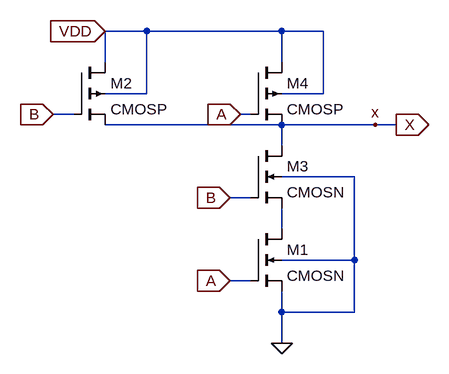
[diagram p0: schematic NAND3mA_2IN_SIMB.asc]
NAND3mA_2IN_SIMB.asc, the LTspice schematic file:
Version 4
SHEET 1 1484 824
WIRE 224 -240 160 -240
WIRE 432 -240 224 -240
WIRE 496 -240 432 -240
WIRE 160 -192 160 -240
WIRE 432 -192 432 -240
WIRE 224 -144 224 -240
WIRE 224 -144 160 -144
WIRE 496 -144 496 -240
WIRE 496 -144 432 -144
WIRE 112 -112 80 -112
WIRE 384 -112 368 -112
WIRE 432 -96 160 -96
WIRE 576 -96 432 -96
WIRE 608 -96 576 -96
WIRE 432 -64 432 -96
WIRE 544 -16 432 -16
WIRE 384 16 352 16
WIRE 432 64 432 32
WIRE 544 112 544 -16
WIRE 544 112 432 112
WIRE 384 144 352 144
WIRE 432 192 432 160
WIRE 544 192 544 112
WIRE 544 192 432 192
WIRE 432 240 432 192
FLAG 432 240 0
FLAG 80 -112 B
IOPIN 80 -112 In
FLAG 576 -96 x
FLAG 368 -112 A
IOPIN 368 -112 In
FLAG 352 16 B
IOPIN 352 16 In
FLAG 352 144 A
IOPIN 352 144 In
FLAG 608 -96 X
IOPIN 608 -96 Out
FLAG 160 -240 VDD
IOPIN 160 -240 In
SYMBOL nmos4 384 64 R0
SYMATTR InstName M1
SYMATTR Value CMOSN
SYMATTR Value2 l=0.6u w=10.8u
SYMBOL pmos4 112 -192 R0
SYMATTR InstName M2
SYMATTR Value CMOSP
SYMATTR Value2 l=.6u w=32.7u
SYMBOL nmos4 384 -64 R0
SYMATTR InstName M3
SYMATTR Value CMOSN
SYMATTR Value2 l=0.6u w=10.8u
SYMBOL pmos4 384 -192 R0
SYMATTR InstName M4
SYMATTR Value CMOSP
SYMATTR Value2 l=.6u w=32.7u

The netlist it stands for:
* NAND3mA_2IN_SIMB.asc
M1 N001 A 0 0 CMOSN l=0.6u w=10.8u
M2 VDD B x VDD CMOSP l=.6u w=32.7u
M3 x B N001 0 CMOSN l=0.6u w=10.8u
M4 VDD A x VDD CMOSP l=.6u w=32.7u
.model NMOS NMOS
.model PMOS PMOS
.lib standard.mos
.backanno
.end